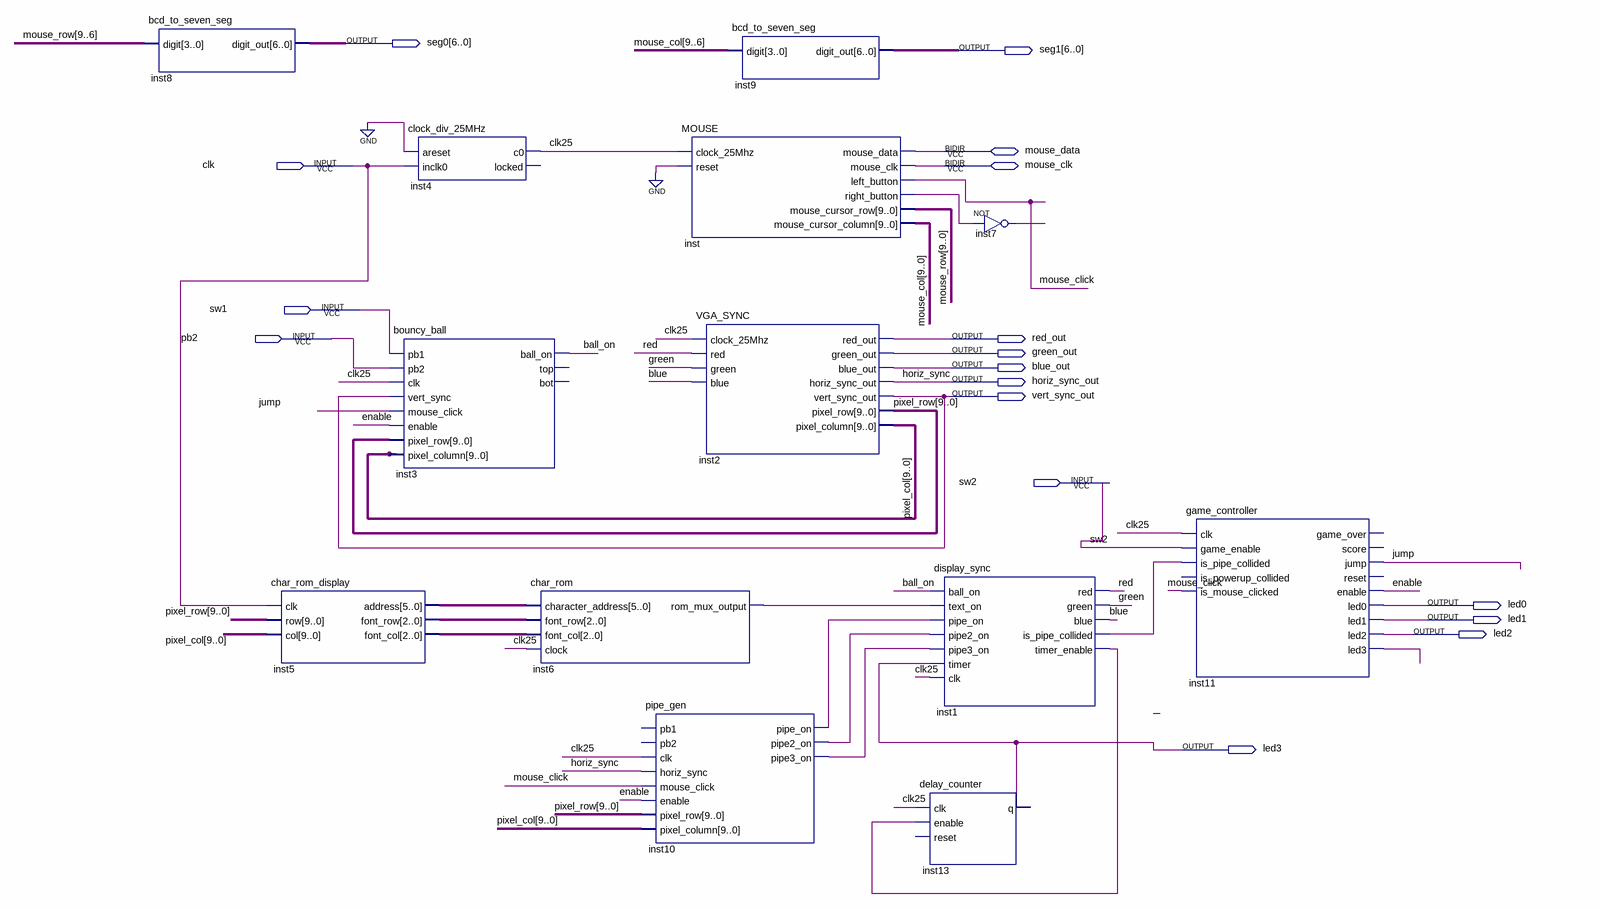
[diagram p0: schematic sheet]
// Quartus schematic old_Flappy_Bird.bdf as structural Verilog: 13 symbols, 17 pins
module old_Flappy_Bird (
  input  clk,
  input  sw1,
  input  pb2,
  input  sw2,
  inout  mouse_data,
  inout  mouse_clk,
  output [6:0] seg0,
  output [6:0] seg1,
  output red_out,
  output green_out,
  output blue_out,
  output horiz_sync_out,
  output vert_sync_out,
  output led0,
  output led1,
  output led2,
  output led3
);

  wire ball_on, blue, clk25, enable, green, inst1_is_pipe_collided, inst1_timer_enable, inst6_rom_mux_output,
       inst7_out, inst10_pipe2_on, inst10_pipe3_on, inst10_pipe_on, inst11_led3, inst_right_button, jump,
       mouse_click, red;
  wire [2:0] inst5_font_col, inst5_font_row;
  wire [5:0] inst5_address;
  wire [9:0] mouse_col, mouse_row, pixel_col, pixel_row;

  bcd_to_seven_seg inst8 (.digit(mouse_row[9:6]), .digit_out(seg0));
  char_rom_display inst5 (
    .clk(clk), .row(pixel_row), .col(pixel_col), .address(inst5_address), .font_row(inst5_font_row),
    .font_col(inst5_font_col));
  clock_div_25MHz inst4 (.areset(1'b0), .inclk0(clk), .c0(clk25));  // open: locked
  bouncy_ball inst3 (
    .pb1(sw1), .pb2(pb2), .clk(clk25), .vert_sync(vert_sync_out), .mouse_click(jump), .enable(enable),
    .pixel_row(pixel_row), .pixel_column(pixel_col), .ball_on(ball_on));  // open: top, bot
  char_rom inst6 (
    .character_address(inst5_address), .font_row(inst5_font_row), .font_col(inst5_font_col), .clock(clk25),
    .rom_mux_output(inst6_rom_mux_output));
  pipe_gen inst10 (
    .clk(clk25), .horiz_sync(horiz_sync_out), .mouse_click(mouse_click), .enable(enable),
    .pixel_row(pixel_row), .pixel_column(pixel_col), .pipe_on(inst10_pipe_on), .pipe2_on(inst10_pipe2_on),
    .pipe3_on(inst10_pipe3_on));  // open: pb1, pb2
  MOUSE inst (
    .clock_25Mhz(clk25), .reset(1'b0), .left_button(mouse_click), .right_button(inst_right_button),
    .mouse_cursor_row(mouse_row), .mouse_cursor_column(mouse_col), .mouse_data(mouse_data),
    .mouse_clk(mouse_clk));
  VGA_SYNC inst2 (
    .clock_25Mhz(clk25), .red(red), .green(green), .blue(blue), .red_out(red_out), .green_out(green_out),
    .blue_out(blue_out), .horiz_sync_out(horiz_sync_out), .vert_sync_out(vert_sync_out),
    .pixel_row(pixel_row), .pixel_column(pixel_col));
  bcd_to_seven_seg inst9 (.digit(mouse_col[9:6]), .digit_out(seg1));
  display_sync inst1 (
    .ball_on(ball_on), .text_on(inst6_rom_mux_output), .pipe_on(inst10_pipe_on), .pipe2_on(inst10_pipe2_on),
    .pipe3_on(inst10_pipe3_on), .timer(led3), .clk(clk25), .red(red), .green(green), .blue(blue),
    .is_pipe_collided(inst1_is_pipe_collided), .timer_enable(inst1_timer_enable));
  delay_counter inst13 (.clk(clk25), .enable(inst1_timer_enable), .q(led3));  // open: reset
  not inst7 (inst7_out, inst_right_button);
  game_controller inst11 (
    .clk(clk25), .game_enable(sw2), .is_pipe_collided(inst1_is_pipe_collided),
    .is_mouse_clicked(mouse_click), .jump(jump), .enable(enable), .led0(led0), .led1(led1), .led2(led2),
    .led3(inst11_led3));  // open: is_powerup_collided, game_over, score, reset

  // Other names for the same wires on the sheet: horiz_sync = horiz_sync_out
endmodule
